# EAGLE design SimpleHATv102A (EAGLE 9.4.2)
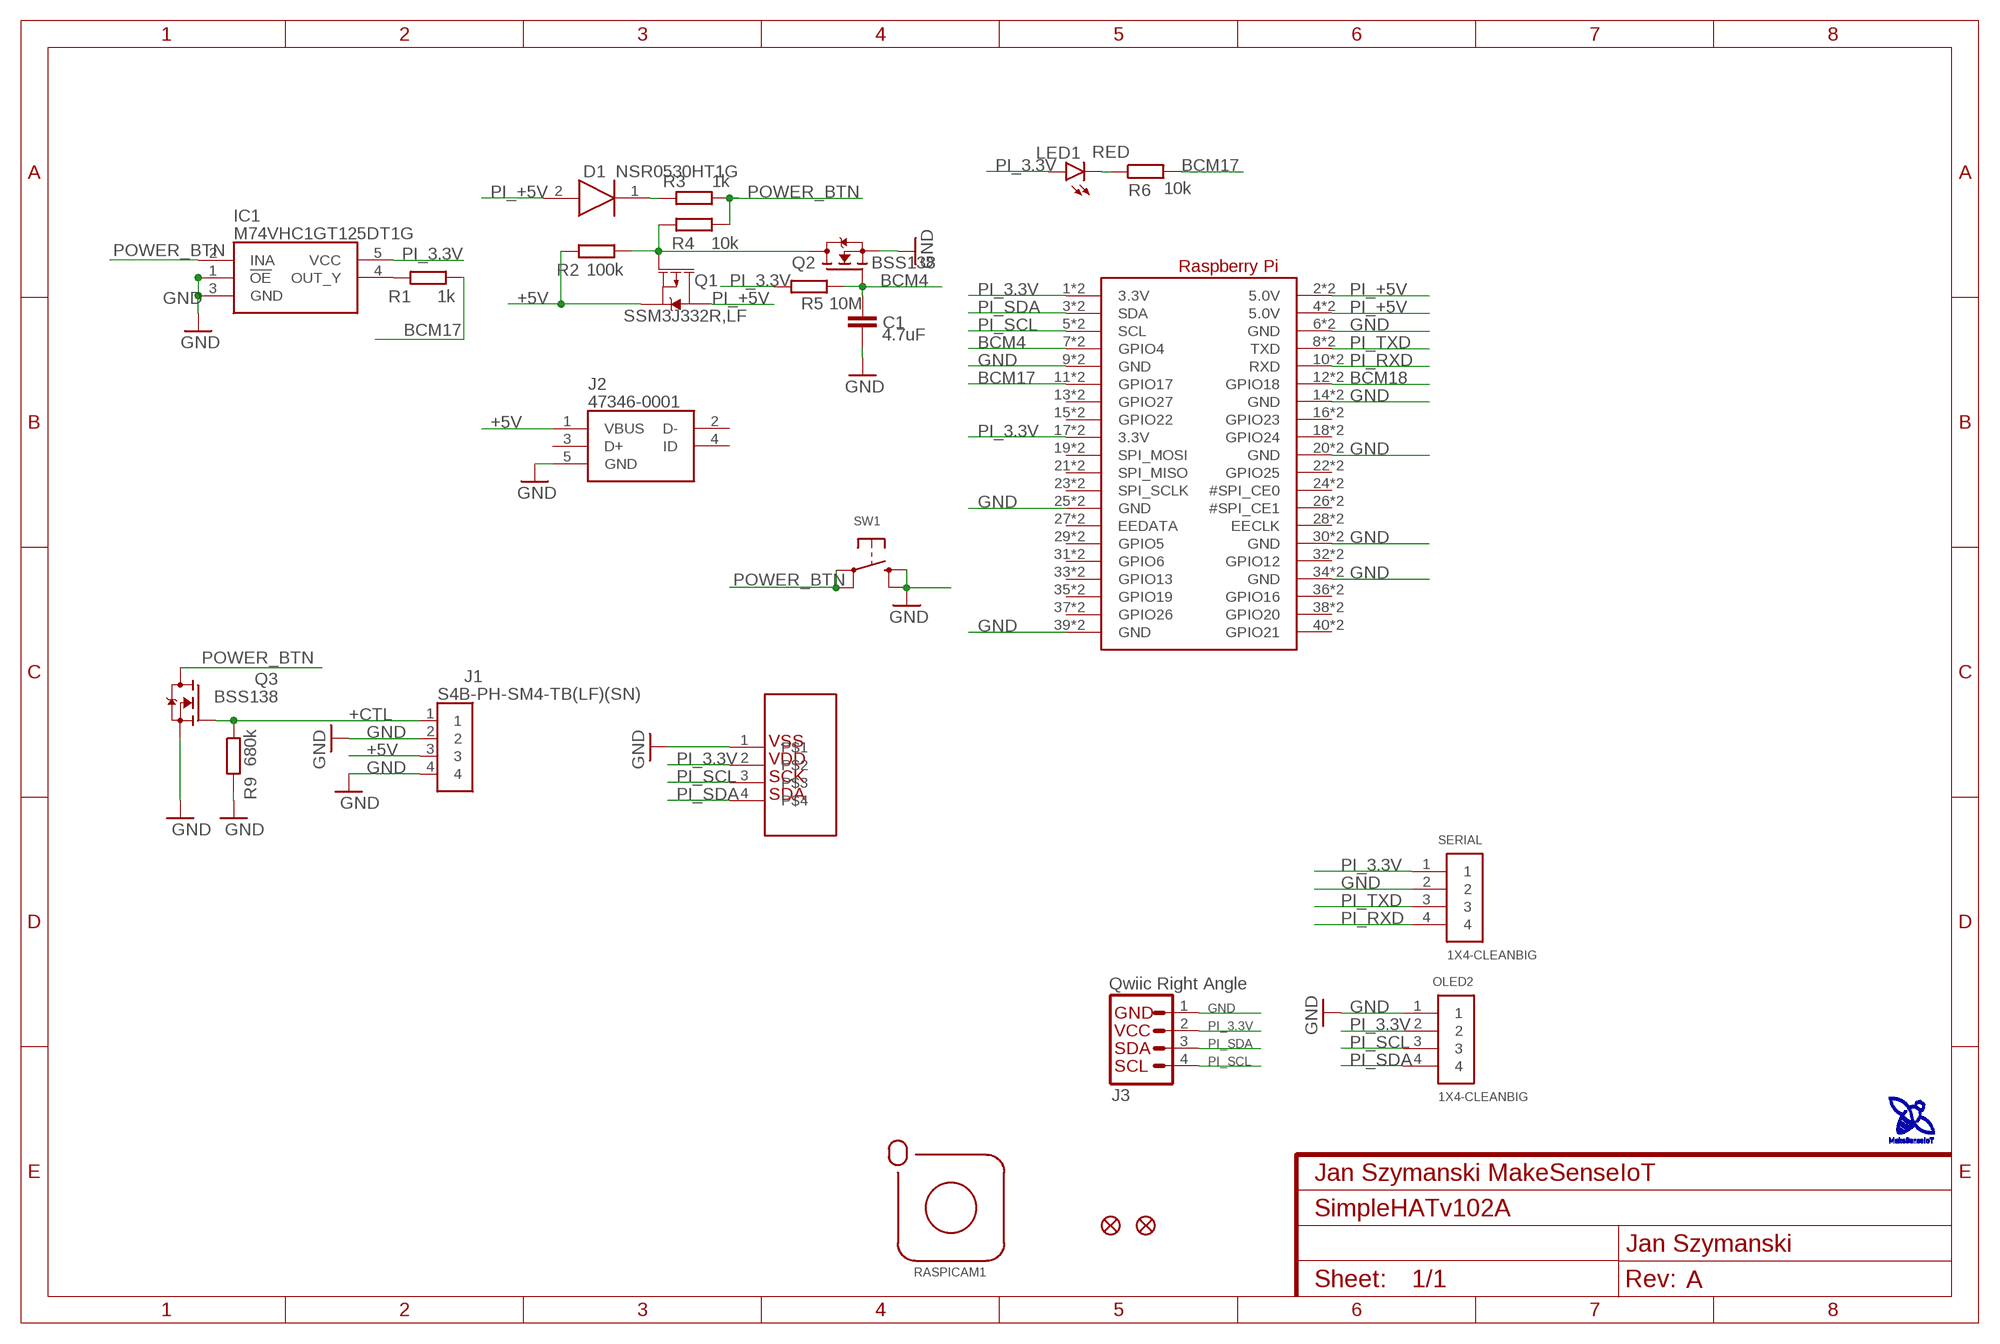
[diagram p0: schematic, sheet 1]
FRAME1 (FRAME-A4L-JANEK): DESIGNER: Jan Szymanski; MYNAME: Jan Szymanski MakeSenseIoT; REV: A

## Parts
C1  4.7uF  C-EUC0805K  [C0805K]
D1  NSR0530HT1G  [SOD2512X110N]
FD1  SPARKFUN-AESTHETICS_FIDUCIAL1X2  [SPARKFUN-AESTHETICS_FIDUCIAL-1X2]
FD2  SPARKFUN-AESTHETICS_FIDUCIAL1X2  [SPARKFUN-AESTHETICS_FIDUCIAL-1X2]
IC1  M74VHC1GT125DT1G  [SOT95P275X110-5N]
J1  S4B-PH-SM4-TB(LF)(SN)  [S4B-PH-SM4-TB]
J2  47346-0001  [47346-0001]
J3  Qwiic Right Angle  SPARKFUN-CONNECTORS_I2C_STANDARDQWIIC  [SPARKFUN-CONNECTORS_JST04_1MM_RA]
LED1  RED  LEDCHIP-LED0603  [CHIP-LED0603]
OLED1  128X32OLEDMODULE0.96"MODULEPCB  [128X32OLED]
OLED2  1X4-CLEANBIG  [1X04-CLEANBIG]
Q1  SSM3J332R,LF  MOSFET_PCH-SI2309DS  [SOT23-3]
Q2  BSS138  [SOT23]
Q3  BSS138  [SOT23]
R1  1k  RR0603  [R0603]
R2  100k  RR0603  [R0603]
R3  1k  RR0603  [R0603]
R4  10k  RR0603  [R0603]
R5  10M  RR0603  [R0603]
R6  10k  RR0603  [R0603]
R9  680k  RR0603  [R0603]
RASPICAM1  RASPICAM  [RASPICAM]
RPI1  ADAFRUIT-LORA-RADIO-BONNET-WITH-OLED_MICROBUILDER_RASPBERRYPI_BPLUS_BONNET_THMSMT  [ADAFRUIT-LORA-RADIO-BONNET-WITH-OLED_MICROBUILDER_PI_BONNET_THMSMT]
SERIAL  1X4-CLEANBIG  [1X04-CLEANBIG]
SW1  MICROBUILDER_SWITCH_TACT_SMTKMT0  [MICROBUILDER_BTN_KMT0]

## Nets
+5V: J1.3 J2.1(VBUS) Q1.2(S) R2.2
+CTL: J1.1 Q3.1(G) R9.1
BCM4: C1.2 Q2.1(G) R5.1 RPI1.7(GPIO4) RPI1.S7(GPIO4)
BCM17: R1.1 R6.2 RPI1.11(GPIO17) RPI1.S11(GPIO17)
BCM18: RPI1.12(GPIO18) RPI1.S12(GPIO18)
GND [GND]: C1.1 IC1.1(!OE) IC1.3(GND) J1.2 J1.4 J2.5(GND) J3.1 OLED1.1 OLED2.1 Q2.2(S) Q3.2(S) R9.2 RPI1.6(GND) RPI1.9(GND) RPI1.14(GND) RPI1.20(GND) RPI1.25(GND) RPI1.30(GND) RPI1.34(GND) RPI1.39(GND) RPI1.S6(GND) RPI1.S9(GND) RPI1.S14(GND) RPI1.S20(GND) RPI1.S25(GND) RPI1.S30(GND) RPI1.S34(GND) RPI1.S39(GND) SERIAL.2 SW1.B'(S1) SW1.B(S)
N$2: IC1.4(OUT_Y) R1.2
N$14: LED1.C R6.1
N$49: D1.1(K) R3.2
N$62: Q1.1(G) Q2.3(D) R2.1 R4.2
PI_3.3V: IC1.5(VCC) J3.2 LED1.A OLED1.2 OLED2.2 R5.2 RPI1.1(3.3V) RPI1.17(3.3V) RPI1.S1(3.3V) RPI1.S17(3.3V) SERIAL.1
PI_+5V: D1.2(A) Q1.3(D) RPI1.2(5.0V) RPI1.4(5.0V) RPI1.S2(5.0V) RPI1.S4(5.0V)
PI_RXD: RPI1.10(RXD) RPI1.S10(RXD) SERIAL.4
PI_SCL: J3.4 OLED1.3 OLED2.3 RPI1.5(SCL) RPI1.S5(SCL)
PI_SDA: J3.3 OLED1.4 OLED2.4 RPI1.3(SDA) RPI1.S3(SDA)
PI_TXD: RPI1.8(TXD) RPI1.S8(TXD) SERIAL.3
POWER_BTN: IC1.2(INA) Q3.3(D) R3.1 R4.1 SW1.A'(P1) SW1.A(P)
Unconnected: J2.2(D-) J2.3(D+) J2.4(ID) RPI1.13(GPIO27) RPI1.15(GPIO22) RPI1.16(GPIO23) RPI1.18(GPIO24) RPI1.19(SPI_MOSI) RPI1.21(SPI_MISO) RPI1.22(GPIO25) RPI1.23(SPI_SCLK) RPI1.24(#SPI_CE0) RPI1.26(#SPI_CE1) RPI1.27(EEDATA) RPI1.28(EECLK) RPI1.29(GPIO5) RPI1.31(GPIO6) RPI1.32(GPIO12) RPI1.33(GPIO13) RPI1.35(GPIO19) RPI1.36(GPIO16) RPI1.37(GPIO26) RPI1.38(GPIO20) RPI1.40(GPIO21) RPI1.S13(GPIO27) RPI1.S15(GPIO22) RPI1.S16(GPIO23) RPI1.S18(GPIO24) RPI1.S19(SPI_MOSI) RPI1.S21(SPI_MISO) RPI1.S22(GPIO25) RPI1.S23(SPI_SCLK) RPI1.S24(#SPI_CE0) RPI1.S26(#SPI_CE1) RPI1.S27(EEDATA) RPI1.S28(EECLK) RPI1.S29(GPIO5) RPI1.S31(GPIO6) RPI1.S32(GPIO12) RPI1.S33(GPIO13) RPI1.S35(GPIO19) RPI1.S36(GPIO16) RPI1.S37(GPIO26) RPI1.S38(GPIO20) RPI1.S40(GPIO21)

## Library data of the parts
C1 = rcl:C-EU: CAPACITOR, European symbol; SPICEPREFIX: C
D1 = SamacSys_Parts:NSR0530HT1G: ON Semi NSR0530HT1G, SMT Schottky Barrier Diode Diode, 30V 500mA, 2-Pin SOD-323 Source: Datasheet <https://eagle.componentsearchengine.com/Datasheets/5/NSR0530HT1G.pdf>; DESCRIPTION: ON Semi NSR0530HT1G, SMT Schottky Barrier Diode Diode, 30V 500mA, 2-Pin SOD-323; HEIGHT: 1.1mm; MANUFACTURER_NAME: ON Semiconductor; MANUFACTURER_PART_NUMBER: NSR0530HT1G; MOUSER_PART_NUMBER: 863-NSR0530HT1G; MOUSER_PRICE-STOCK: https://www.mouser.com/Search/Refine.aspx?Keyword=863-NSR0530HT1G; RS_PART_NUMBER: 1630277; RS_PRICE-STOCK: http://uk.rs-online.com/web/p/products/1630277
FD1 FD2 = Janek-Eagle:SPARKFUN-AESTHETICS_FIDUCIAL: Fiducial Alignment Points Point-of-reference for pick-and-place machines and other optical instruments.
IC1 = Janek-Eagle:M74VHC1GT125DT1G: ON SEMICONDUCTOR - M74VHC1GT125DT1G - IC, BUFF CMOS LVL/SFTR N-I SOT235 Source: Datasheet <http://www.onsemi.com/pub/Collateral/MC74VHC1GT125-D.PDF>; ALLIED_NUMBER: 70100452; ALLIED_PRICE-STOCK: http://www.alliedelec.com/on-semiconductor-m74vhc1gt125dt1g/70100452/; DESCRIPTION: ON SEMICONDUCTOR - M74VHC1GT125DT1G - IC, BUFF CMOS LVL/SFTR N-I SOT235; HEIGHT: 1.1mm; MANUFACTURER_NAME: ON Semiconductor; MANUFACTURER_PART_NUMBER: M74VHC1GT125DT1G; MOUSER_PART_NUMBER: 863-M74VHC1GT125DT1G; MOUSER_PRICE-STOCK: https://www.mouser.com/Search/Refine.aspx?Keyword=863-M74VHC1GT125DT1G; RS_PART_NUMBER: 1628904; RS_PRICE-STOCK: http://uk.rs-online.com/web/p/products/1628904
J1 = Janek-Eagle:S4B-PH-SM4-TB(LF)(SN): PH SMT side entry shroud header 4 way JST PH Series, 2mm Pitch 4 Way 1 Row Right Angle PCB Header, Solder Termination, 2A Source: Datasheet <http://uk.rs-online.com/web/p/products/6881366>; DESCRIPTION: PH SMT side entry shroud header 4 way JST PH Series, 2mm Pitch 4 Way 1 Row Right Angle PCB Header, Solder Termination, 2A; HEIGHT: mm; MANUFACTURER_NAME: JST (JAPAN SOLDERLESS TERMINALS); MANUFACTURER_PART_NUMBER: S4B-PH-SM4-TB(LF)(SN); RS_PART_NUMBER: 6881366P; RS_PRICE-STOCK: http://uk.rs-online.com/web/p/products/6881366P
J2 = Janek-Eagle:47346-0001: Micro USB B Receptacle Bottom Mount Assy Molex Right Angle SMT Type B Version 2.0 Micro USB Connector Socket, 30 V ac, 1A 47352 MICRO-USB Source: Datasheet <http://www.molex.com/pdm_docs/sd/473460001_sd.pdf>; ALLIED_NUMBER: 70266948; ALLIED_PRICE-STOCK: https://www.alliedelec.com/molex-incorporated-47346-0001/70266948/; DESCRIPTION: Micro USB B Receptacle Bottom Mount Assy Molex Right Angle SMT Type B Version 2.0 Micro USB Connector Socket, 30 V ac, 1A 47352 MICRO-USB; HEIGHT: mm; MANUFACTURER_NAME: Molex; MANUFACTURER_PART_NUMBER: 47346-0001; MOUSER_PART_NUMBER: 538-47346-0001; MOUSER_PRICE-STOCK: https://www.mouser.com/Search/Refine.aspx?Keyword=538-47346-0001; RS_PART_NUMBER: 7025475P; RS_PRICE-STOCK: http://uk.rs-online.com/web/p/products/7025475P
J3 = Janek-Eagle:SPARKFUN-CONNECTORS_I2C_STANDARD: SparkFun I2C Standard Pinout Header SparkFun has standardized on a pinout for all I2C based sensor breakouts. This pinout allows I2C boards to be plugged directly into the headers on Arduino Uno compatible boards, and to be daisy chained easily. Example SparkFun Products: SparkFun Atmospheric Sensor Breakout - BME280 <https://www.sparkfun.com/products/13676> SparkFun Altitude/Pressure Sensor Breakout - MPL3115A2 <https://www.sparkfun.com/products/11084> SparkFun TOF Range Finder Sensor - VL6180 <https://www.sparkfun.com/products/12785>; PROD_ID: CONN-13694
LED1 = led:LED: LED OSRAM: - CHIPLED LG R971, LG N971, LY N971, LG Q971, LY Q971, LO R971, LY R971 LH N974, LH R974 LS Q976, LO Q976, LY Q976 LO Q996 - Hyper CHIPLED LW Q18S LB Q993, LB Q99A, LB R99A - SideLED LS A670, LO A670, LY A670, LG A670, LP A670 LB A673, LV A673, LT A673, LW A673 LH A674 LY A675 LS A676, LA A676, LO A676, LY A676, LW A676 LS A679, LY A679, LG A679 - Hyper Micro SIDELED® LS Y876, LA Y876, LO Y876, LY Y876 LT Y87S - SmartLED LW L88C, LW L88S LB L89C, LB L89S, LG L890 LS L89K, LO L89K, LY L89K LS L896, LA L896, LO L896, LY L896 - TOPLED LS T670, LO T670, LY T670, LG T670, LP T670 LSG T670, LSP T670, LSY T670, LOP T670, LYG T670 LG T671, LOG T671, LSG T671 LB T673, LV T673, LT T673, LW T673 LH T674 LS T676, LA T676, LO T676, LY T676, LB T676, LH T676, LSB T676, LW T676 LB T67C, LV T67C, LT T67C, LS T67K, LO T67K, LY T67K, LW E67C LS E67B, LA E67B, LO E67B, LY E67B, LB E67C, LV E67C, LT E67C LW T67C LS T679, LY T679, LG T679 LS T770, LO T770, LY T770, LG T770, LP T770 LB T773, LV T773, LT T773, LW T773 LH T774 LS E675, LA E675, LY E675, LS T675 LS T776, LA T776, LO T776, LY T776, LB T776 LHGB T686 LT T68C, LB T68C - Hyper Mini TOPLED® LB M676 - Mini TOPLED Santana® LG M470 LS M47K, LO M47K, LY M47K Source: http://www.osram.convergy.de LUXEON: - LUMILED® LXK2-PW12-R00, LXK2-PW12-S00, LXK2-PW14-U00, LXK2-PW14-V00 LXK2-PM12-R00, LXK2-PM12-S00, LXK2-PM14-U00 LXK2-PE12-Q00, LXK2-PE12-R00, LXK2-PE12-S00, LXK2-PE14-T00, LXK2-PE14-U00 LXK2-PB12-K00, LXK2-PB12-L00, LXK2-PB12-M00, LXK2-PB14-N00, LXK2-PB14-P00, LXK2-PB14-Q00 LXK2-PR12-L00, LXK2-PR12-M00, LXK2-PR14-Q00, LXK2-PR14-R00 LXK2-PD12-Q00, LXK2-PD12-R00, LXK2-PD12-S00 LXK2-PH12-R00, LXK2-PH12-S00 LXK2-PL12-P00, LXK2-PL12-Q00, LXK2-PL12-R00 Source: www.luxeon.com KINGBRIGHT: KA-3528ASYC Source: www.kingbright.com
OLED1 = Janek-Eagle:128X32OLEDMODULE
OLED2 SERIAL = adafruit_old:1X4: 4-pin connector
Q1 = Janek-Eagle:MOSFET_PCH: P-channel MOSFETs Voltage controlled devices that allow control of high current outputs. SparkFun Products: SparkFun ESP32 Thing <https://www.sparkfun.com/products/13907> SparkFun ESP8266 Thing <https://www.sparkfun.com/products/13231>; PROD_ID: TRANS-08285; VALUE: 1.1A/60V/600mΩ
Q2 Q3 = bss138_10:BSS138: BSS138 N-Channel Logic Level Enhancement Mode Field Effect Transistor Source: http://www.fairchildsemi.com/datasheets/BS/BSS138.pdf; MF: Fairchild; MPN: BSS138; OC_FARNELL: 9845330; OC_NEWARK: 67R2009
R1-R6 R9 = eagle-ltspice:R: RESISTOR, European symbol; SPICEMODEL: NONE; SPICEPREFIX: R
RASPICAM1 = Janek-Eagle:RASPICAM
RPI1 = Janek-Eagle:ADAFRUIT-LORA-RADIO-BONNET-WITH-OLED_MICROBUILDER_RASPBERRYPI_BPLUS
SW1 = Adafruit nRF52840 Bluefruit Feather Express Rev D:MICROBUILDER_SWITCH_TACT_SMT: SMT Tact Switches 6x6mm - Digikey: P12940SCT-ND KMR2 (4.6x2.8mm) - Digikey: 401-1426-1-ND EVQ-PQHB55 - Light Touch, 160GF (4.5x4.5mm) - Digikey: P8090SCT-ND KMT0 - KMT021 NGJ LHS (etc.) IP68/Waterproof - Digikey: CKN10289CT-ND

## Net classes
0 Default: width 0.178 mm
1 VCC: width 0.178 mm, clearance 0.254 mm
2 GND: clearance 0.762 mm

## Board
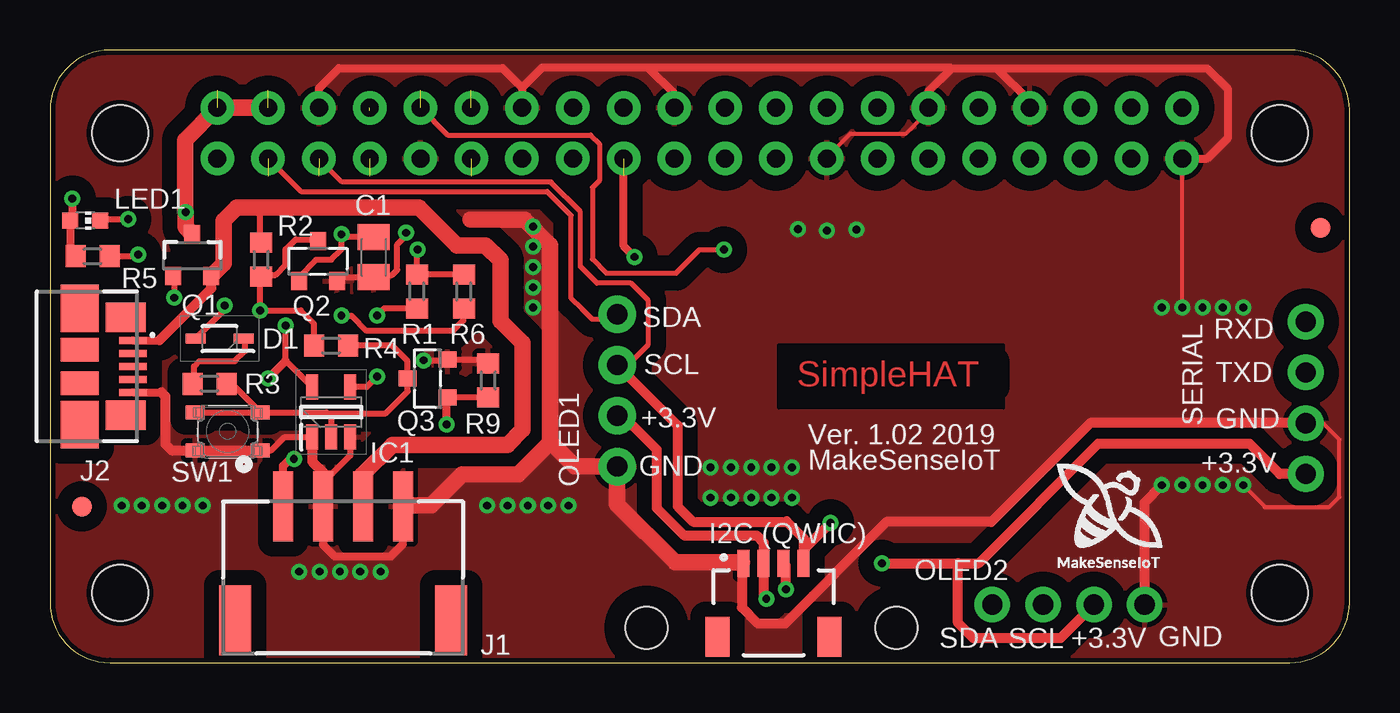
[diagram p1: board, top side]
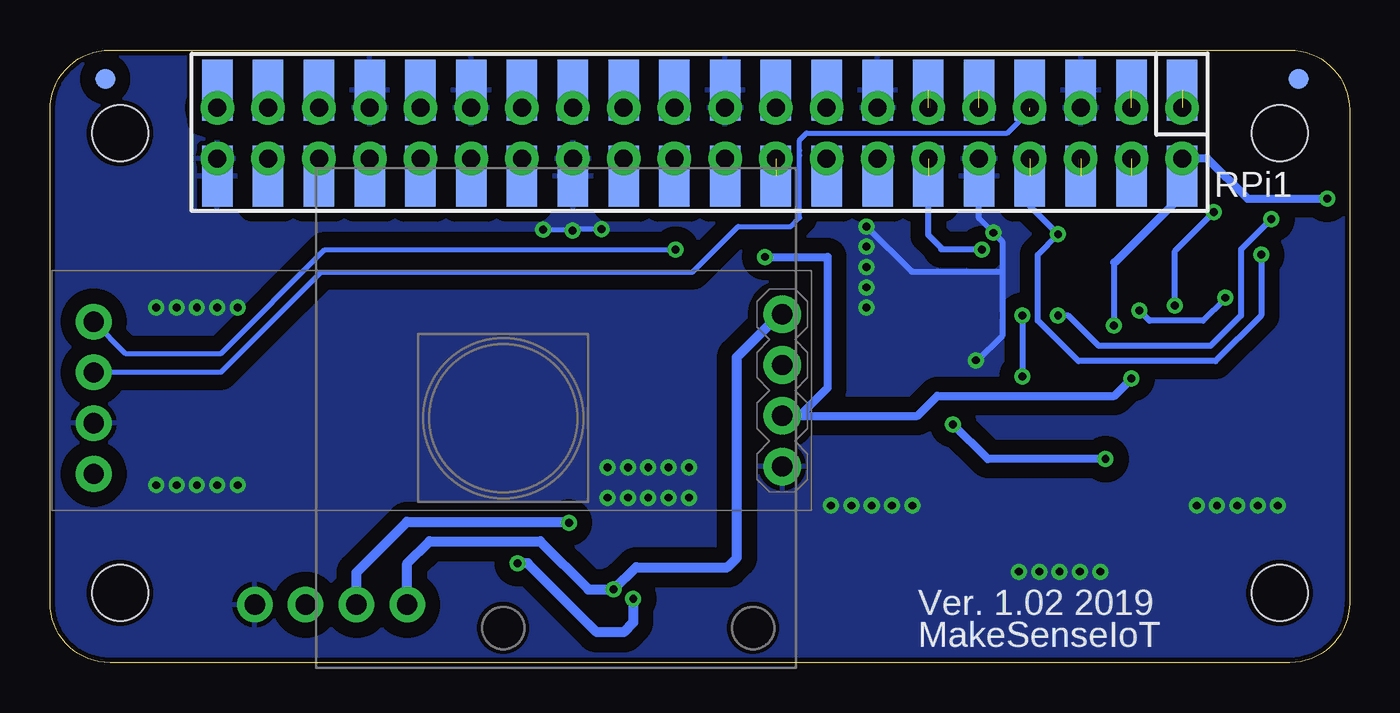
[diagram p2: board, bottom side, seen from below]

Size 65 x 30.66 mm. Coordinates in mm from the lower left corner, seen from the top.
Copper layers (1*16): Top 0.035mm / dielectric 1.5mm / Bottom 0.035mm
Design rules "adafruit *": minimum track width 8mil, minimum drill 15.5mil, track to track 8mil, track to pad 8mil, pad to pad 8mil, via to via 8mil, smd to smd 8mil, copper to edge 10mil, drill to drill 8mil, minimum pad ring 10mil, minimum via ring 8mil, stop-mask expansion 2mil, vias tented up to drill 20mil, thermal gap 10mil
tRestrict: 4 lines

### Footprints (pad centres in the part's own frame; a part is rotated, then mirrored left to right if it is on the bottom)
C0805K = smd 1.3 x 1.6: 1 -1,0; 2 1,0
SOD2512X110N = smd 1 x 0.5: 1 -1.2,0; 2 1.2,0
SPARKFUN-AESTHETICS_FIDUCIAL-1X2 = smd 1 x 1: 1 0,0
SOT95P275X110-5N = smd 1.25 x 0.6: 1 -1.25,0.95; 2 -1.25,0; 3 -1.25,-0.95; 4 1.25,-0.95; 5 1.25,0.95
S4B-PH-SM4-TB = smd 1 x 3.5: 1 6,0; 2 4,0; 3 2,0; 4 0,0 | smd 1.6 x 3.5: 5 -2.4,5.7; 6 8.4,5.7
47346-0001 = smd 0.35 x 1.38: 1 1.3,-4.81; 2 0.65,-4.81; 3 0,-4.81; 4 -0.65,-4.81; 5 -1.3,-4.81 | smd 1.475 x 2: 6 -2.453,-4.45; 7 2.453,-4.45 | smd 1.175 x 1.9: 8 0.838,-2.15; 9 -0.838,-2.15 | smd 2.375 x 1.9: 10 2.913,-2.15; 11 -2.913,-2.15
SPARKFUN-CONNECTORS_JST04_1MM_RA = smd 0.6 x 1.35: 1 -1.5,0; 2 -0.5,0; 3 0.5,0; 4 1.5,0 | smd 1.2 x 2: NC1 2.8,-3.675; NC2 -2.8,-3.675
CHIP-LED0603 = smd 0.8 x 0.8: A 0,-0.75; C 0,0.75
128X32OLED = drill 1.016 pad 1.88: 1 1.45,2.2; 2 1.45,4.74; 3 1.45,7.28; 4 1.45,9.82
1X04-CLEANBIG = drill 1.016 pad 1.778: 1 -3.81,0; 2 -1.27,0; 3 1.27,0; 4 3.81,0
SOT23-3 = smd 0.8 x 0.9: 1 -0.95,-1; 2 0.95,-1; 3 0,1.1
SOT23 = smd 0.8 x 0.9: 1 -0.95,-1; 2 0.95,-1; 3 0,1
R0603 = smd 1 x 1.1: 1 -0.85,0; 2 0.85,0
RASPICAM = hole 2.1: 2.15,2; 14.65,2
ADAFRUIT-LORA-RADIO-BONNET-WITH-OLED_MICROBUILDER_PI_BONNET_THMSMT = drill 0.9 pad 1.676: 1 8.37,25.23; 2 8.37,27.77; 3 10.91,25.23; 4 10.91,27.77; 5 13.45,25.23; 6 13.45,27.77; 7 15.99,25.23; 8 15.99,27.77; 9 18.53,25.23; 10 18.53,27.77; 11 21.07,25.23; 12 21.07,27.77; 13 23.61,25.23; 14 23.61,27.77; 15 26.15,25.23; 16 26.15,27.77; 17 28.69,25.23; 18 28.69,27.77; 19 31.23,25.23; 20 31.23,27.77; 21 33.77,25.23; 22 33.77,27.77; 23 36.31,25.23; 24 36.31,27.77; 25 38.85,25.23; 26 38.85,27.77; 27 41.39,25.23; 28 41.39,27.77; 29 43.93,25.23; 30 43.93,27.77; 31 46.47,25.23; 32 46.47,27.77; 33 49.01,25.23; 34 49.01,27.77; 35 51.55,25.23; 36 51.55,27.77; 37 54.09,25.23; 38 54.09,27.77; 39 56.63,25.23; 40 56.63,27.77 | smd 1 x 1 bottom: 41 2.54,29.21; 42 62.23,29.21 | smd 1.524 x 3.048 bottom: S1 8.37,24.339; S2 8.37,28.657; S3 10.91,24.339; S4 10.91,28.657; S5 13.45,24.339; S6 13.45,28.657; S7 15.99,24.339; S8 15.99,28.657; S9 18.53,24.339; S10 18.53,28.657; S11 21.07,24.339; S12 21.07,28.657; S13 23.61,24.339; S14 23.61,28.657; S15 26.15,24.339; S16 26.15,28.657; S17 28.69,24.339; S18 28.69,28.657; S19 31.23,24.339; S20 31.23,28.657; S21 33.77,24.339; S22 33.77,28.657; S23 36.31,24.339; S24 36.31,28.657; S25 38.85,24.339; S26 38.85,28.657; S27 41.39,24.339; S28 41.39,28.657; S29 43.93,24.339; S30 43.93,28.657; S31 46.47,24.339; S32 46.47,28.657; S33 49.01,24.339; S34 49.01,28.657; S35 51.55,24.339; S36 51.55,28.657; S37 54.09,24.339; S38 54.09,28.657; S39 56.63,24.339; S40 56.63,28.657 | hole 2.8: 3.5,26.5; 61.5,26.5; 61.5,3.5; 3.5,3.5
MICROBUILDER_BTN_KMT0 = smd 0.95 x 0.7: A -1.625,0.95; A' 1.625,0.95; B -1.625,-0.95; B' 1.625,-0.95

### Placement (x,y rotation side)
C1  16.2,20.29 90 top
D1  8.49,16.21 180 top
FD1  1.59,7.81 0 top
FD2  63.54,21.77 0 top
IC1  14.07,12.55 90 top
J1  17.66,7.81 180 top
J2  -0.66,14.83 90 top
J3  36.2,4.98 0 top
LED1  1.77,22.13 270 top
OLED1  26.92,7.62 0 top
OLED2  50.94,2.91 180 top
Q1  7.12,20.36 0 top
Q2  13.4,20.09 0 top
Q3  18.9,14.22 90 top
R1  18.36,18.58 270 top
R2  10.56,20.16 90 top
R3  7.98,13.96 180 top
R4  14.06,15.86 180 top
R5  2.13,20.34 180 top
R6  20.71,18.58 90 top
R9  21.92,14.12 90 top
RASPICAM1  27.69,-0.25 0 top
RPI1  0,0 0 top
SERIAL  62.81,13.26 90 top
SW1  8.89,11.58 0 top

### Tracks (layer width: path | path; a pad name or v marks a point on that pad's centre or on a via)
+5V
  Top 0.305: R2.2 10.51,21.06 10.51,22.78
  Top 0.406: J2.1 5.46,16.13
  Top 0.508: 8.08,19.35 Q1.2 8.07,18.73 5.46,16.13
  Top 0.813: Q1.2 8.68,19.98 8.68,22.12 9.35,22.78 10.51,22.78 18.46,22.78 20.37,20.88 21.79,20.88 22.53,20.14 22.53,17.11 23.65,15.99 23.65,11.67 22.88,10.91 17.14,10.91 15.62,9.39 15.62,7.85 J1.3
+CTL  (via drill 0.39)
  Top 0.305: 21.95,13.3 R9.1 Q3.1
  Top 0.406: J1.1 11.66,9.85 12.1,10.29 v12.2,10.19 | v19.84,11.93 19.84,13.21 Q3.1
  Bottom 0.406: v12.2,10.19 18.1,10.19 v19.84,11.93
BCM4  (via drill 0.39)  (1 unrouted)
  Top 0.305: C1.2 14.72,21.29 v14.58,21.44 14.58,20.67 14.07,20.17 13.31,20.17 12.45,19.31 Q2.1 | R5.1 4.34,20.34 v4.42,20.42
  Bottom 0.305: v4.42,20.42 4.42,17.37 6.7,15.09 13.56,15.09 15.59,17.12 15.59,20.42 v14.58,21.44 15.99,22.85 RPI1.7
BCM17  (via drill 0.39)  (1 unrouted)
  Top 0.305: R6.2 R1.1 18.36,20.64 v18.39,20.67
  Bottom 0.305: v18.39,20.67 20.34,20.67 | 20.34,20.67 20.42,20.67 | 20.34,20.67 21.07,21.4 RPI1.11
BCM18  (1 unrouted)
GND  (via drill 0.39)
  Top 0.203: RPI1.25 38.85,25.3 40.03,26.48 42.82,26.48 43.91,27.57 43.91,27.79 | v59.68,8.89 60.76,7.82 60.76,7.79 63.98,7.79 64.49,8.29 64.49,11.16 63.67,11.99 SERIAL.2 | v56.64,17.78 RPI1.39
  Top 0.305: SW1.B' 11.06,10.63 11.73,11.3 IC1.1 | IC1.3 15.02,10.37 14.12,9.47 13.69,9.47 | R9.2 21.72,15.17 Q3.2 19.86,15.13 v18.69,15.13 | Q2.2 14.56,19.29 C1.1 16.31,19.4 17.12,19.4 17.37,19.66 17.37,20.93 17.88,21.44 v17.8,21.51
  Top 0.406: J1.2 13.66,7.58 13.66,5.91 14.25,5.32 17.04,5.32 17.66,5.94 J1.4 | J2.5 5.57,13.53 | RPI1.6 13.45,28.76 14.45,29.76 22.63,29.76 23.61,28.78 | 23.61,28.78 RPI1.14 | RPI1.20 31.23,28.47 29.92,29.78 | 29.92,29.78 24.61,29.78 23.61,28.78 | RPI1.34 49.01,28.09 47.37,29.73 | 47.37,29.73 45.08,29.73 | 45.08,29.73 43.91,28.56 43.91,27.79 RPI1.30 | 45.08,29.73 45.03,29.78 29.92,29.78 | RPI1.39 57.88,25.23 58.93,26.28 58.93,28.69 57.89,29.73 47.37,29.73
  Top 0.508: 5.57,13.53 5.76,13.33 5.76,10.95 6.08,10.63 SW1.B SW1.B' | 34.61,5.03 34.61,2.77 35.42,1.96 36.76,1.96 41.84,7.04 47.09,7.04 52.03,11.99 SERIAL.2 | IC1.1 13.12,10.06 13.69,9.49 13.69,7.61 13.66,7.58 | OLED2.1 54.75,8.02 v55.62,8.89
  Top 0.813: 21.03,22.17 23.75,22.17 25.02,20.9 25.02,11.01 | J1.4 17.71,7.86 19.07,7.86 20.62,9.41 23.42,9.41 25.02,11.01 | 25.02,11.01 25.07,11.01 26.26,9.82 OLED1.1 28.37,7.93 31.28,5.03 34.61,5.03
  Bottom 0.254: v17.8,21.51 18.53,22.24 | v37.41,21.69 38.78,21.69 38.79,21.68 | 38.79,21.68 38.86,21.68 | v40.33,21.66 38.8,21.66 38.79,21.68
  Bottom 0.305: v17.8,21.51 17.37,21.08 17.37,19.57 | 17.37,19.57 17.37,16.36 18.64,15.09 v18.69,15.13 | 18.53,22.24 RPI1.9 | v24.15,21.83 21.89,19.57 17.37,19.57
  other vias: 3.58,7.86 4.6,7.86 5.61,7.86 6.63,7.86 7.64,7.86 12.47,4.56 13.49,4.56 14.5,4.56 15.52,4.56 16.53,4.56 21.87,7.86 22.88,7.86 23.9,7.86 24.92,7.86 25.93,7.86 24.15,17.77 24.15,18.78 24.15,19.8 24.15,20.82 55.62,17.78 57.65,17.78 58.67,17.78 59.68,17.78 33.04,9.78 34.06,9.78 35.08,9.78 36.09,9.78 37.11,9.78 33.04,8.26 34.06,8.26 35.08,8.26 36.09,8.26 37.11,8.26 58.67,8.89 57.65,8.89 56.64,8.89 38.86,21.61
  pour Bottom: -1.25,-1.28 66.06,-1.28 66.06,31.74 -1.25,31.74
  pour Top: -2.52,-2.55 -2.52,33.01 67.33,33.01 67.33,-2.55
N$2  (via drill 0.39)
  Top 0.305: R1.2 16.72,17.73 v16.36,17.37 | v16.36,14.32 15.83,13.8 IC1.4
  Bottom 0.305: v16.36,17.37 v16.36,14.32
N$14  (via drill 0.39)
  Top 0.305: R6.1 20.67,17.69 20.67,17.12 20.17,16.61 15.85,16.61 15.09,17.37 v14.58,17.37 | LED1.C 2.59,22.2 v3.91,22.2
  Bottom 0.305: v3.91,22.2 5.43,20.67 5.43,17.37 6.96,15.85 12.55,15.85 14.07,17.37 v14.58,17.37
N$49
  Top 0.305: R3.2 7.21,14.04 7.21,14.83 7.47,15.09 9.24,15.09 9.75,15.59 9.75,16.15 D1.1
N$62  (via drill 0.39)
  Top 0.305: Q2.3 13.31,21.18 12.29,21.18 11.78,20.67 11.78,19.91 11.28,19.4 10.65,19.4 R2.1 10.51,19.26 v10.51,17.63 12.55,17.63 13.21,16.96 R4.2 | Q1.1 6.22,19.3 v6.22,18.26
  Bottom 0.305: v6.22,18.26 6.22,18.21 7.31,17.12 10.01,17.12 v10.51,17.63
PI_3.3V  (via drill 0.39)  (1 unrouted)
  Top 0.305: IC1.5 11.78,15.13 v11.78,16.86
  Top 0.406: v1.12,23.21 1.12,22.22 LED1.A 1.02,20.6 R5.2 | v29.23,20.31 28.69,20.85 RPI1.17 | v10.91,14.23 11.78,15.1 11.78,15.13
  Top 0.508: OLED1.2 28.66,12.36 30.36,10.66 30.36,7.73 31.74,6.35 35.35,6.35 35.7,6 J3.2 35.7,3.34 35.7,3.33 v35.83,3.2 | SERIAL.1 61.5,9.45 59.99,10.96 52.43,10.96 46.45,4.98 45.41,4.98 | v41.61,4.98 45.41,4.98 | OLED2.2 50.54,1.23 46.18,1.23 45.41,2 45.41,4.98
  Bottom 0.305: 11.78,20.03 v11.78,16.86
  Bottom 0.406: v1.12,23.21 5.09,23.21 7.1,25.23 RPI1.1 8.41,25.19 | 8.41,25.19 8.41,23.36 11.73,20.03 11.78,20.03 | v29.23,20.31 26.11,20.31 26.11,13.76 27.5,12.36 OLED1.2 21.61,12.36 20.62,13.35 11.76,13.35 10.89,14.21 v10.91,14.23 | RPI1.S1 8.37,25.16 8.41,25.19
  Bottom 0.508: v35.83,3.2 35.83,2 36.3,1.53 37.66,1.53 41.1,4.98 v41.61,4.98
PI_+5V  (via drill 0.39)  (2 unrouted)
  Top 0.305: D1.2 8.74,17.66 v8.74,17.88
  Top 0.508: Q1.3 6.96,21.61
  Top 0.813: Q1.3 6.79,21.79 v6.79,22.55 6.75,22.58 6.75,26.16 RPI1.2 RPI1.4
  Bottom 0.305: v8.74,17.88 8.74,20.6 v6.79,22.55
PI_RXD  (via drill 0.39)  (1 unrouted)
  Top 0.254: RPI1.10 19.9,26.4 27.04,26.4 27.48,25.97 27.48,24.13 27.13,23.78 27.13,20.19 27.82,19.5 31.32,19.5 32.48,20.66 v33.7,20.66
  Bottom 0.254: SERIAL.4 61.23,15.48 56.44,15.48 51.26,20.66 v33.7,20.66
PI_SCL  (via drill 0.39)  (1 unrouted)
  Top 0.254: OLED1.3 28.91,14.9 29.93,15.93 29.93,18.11 29.06,18.99 27.35,18.99 26.53,19.81 26.53,22.57 25.07,24.03 25.07,24.06 14.62,24.06 RPI1.5
  Top 0.508: OLED1.3 31.4,11.88 31.4,7.83 32.17,7.06 36.82,7.06 36.84,7.08 37.7,6.23 J3.4 37.7,5.66 v39.04,7
  Bottom 0.508: OLED2.3 49.67,4.52 47.14,7.05 39.04,7.05 v39.04,7
PI_SDA  (via drill 0.39)  (1 unrouted)
  Top 0.254: OLED1.4 28.11,17.18 27.13,17.18 26.61,17.69 26.07,18.23 26.07,22.38 24.86,23.59 12.55,23.59 RPI1.3
  Top 0.508: 36.67,3.8 v36.8,3.67 36.8,4.87 J3.3
  Bottom 0.508: OLED1.4 28.5,17.44 30.65,15.29 30.65,5.25 31.11,4.78 35.69,4.78 v36.8,3.67 38.07,3.67 40.49,6.08 46.02,6.08 47.13,4.97 OLED2.4
PI_TXD  (1 unrouted)
  Bottom 0.254: SERIAL.3 56.46,14.53 51.44,19.55 32.87,19.55 30.58,21.83 27.94,21.83 27.51,22.26 27.51,25.39 27.51,25.64 27.51,26.15 27.15,26.51 17.12,26.51 15.99,27.63 RPI1.S8
POWER_BTN
  Top 0.305: R3.1 9.1,13.96 10.51,12.55 SW1.A' | SW1.A SW1.A' | SW1.A' 13.83,12.53 13.88,12.48 | 13.88,12.48 14.07,12.29 IC1.2 | 13.88,12.48 16.8,12.48 17.9,13.58 Q3.3 17.88,14.24 17.88,15.09 17.1,15.86 R4.1

### Text on the board
Top: SimpleHAT
tNames: SDA | RXD | SCL | TXD | +3.3V | GND | Ver. 1.02 2019 / MakeSenseIoT | +3.3V | GND | I2C (QWIIC) | SCL | SDA | +3.3V | GND
bNames: RPi1 | Ver. 1.02 2019 / MakeSenseIoT
tStop: SimpleHAT